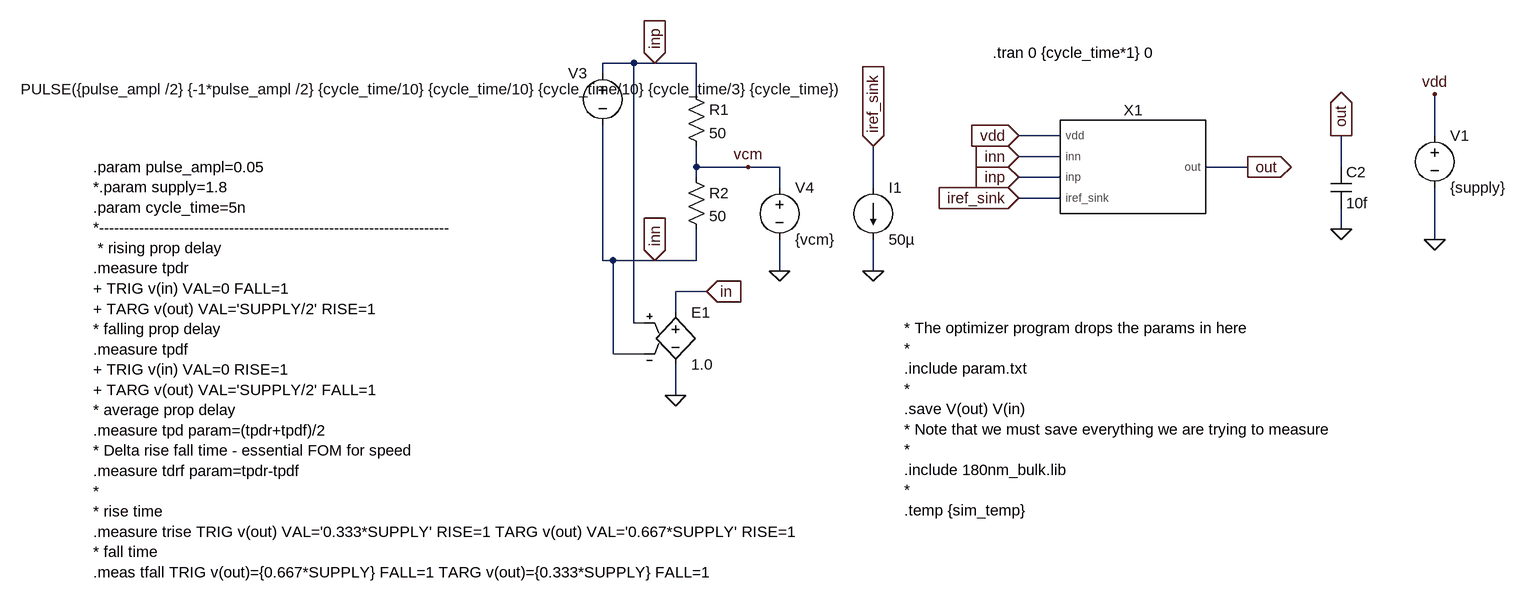
[diagram p0: schematic lvds_rcvr_testbed_v3.asc]
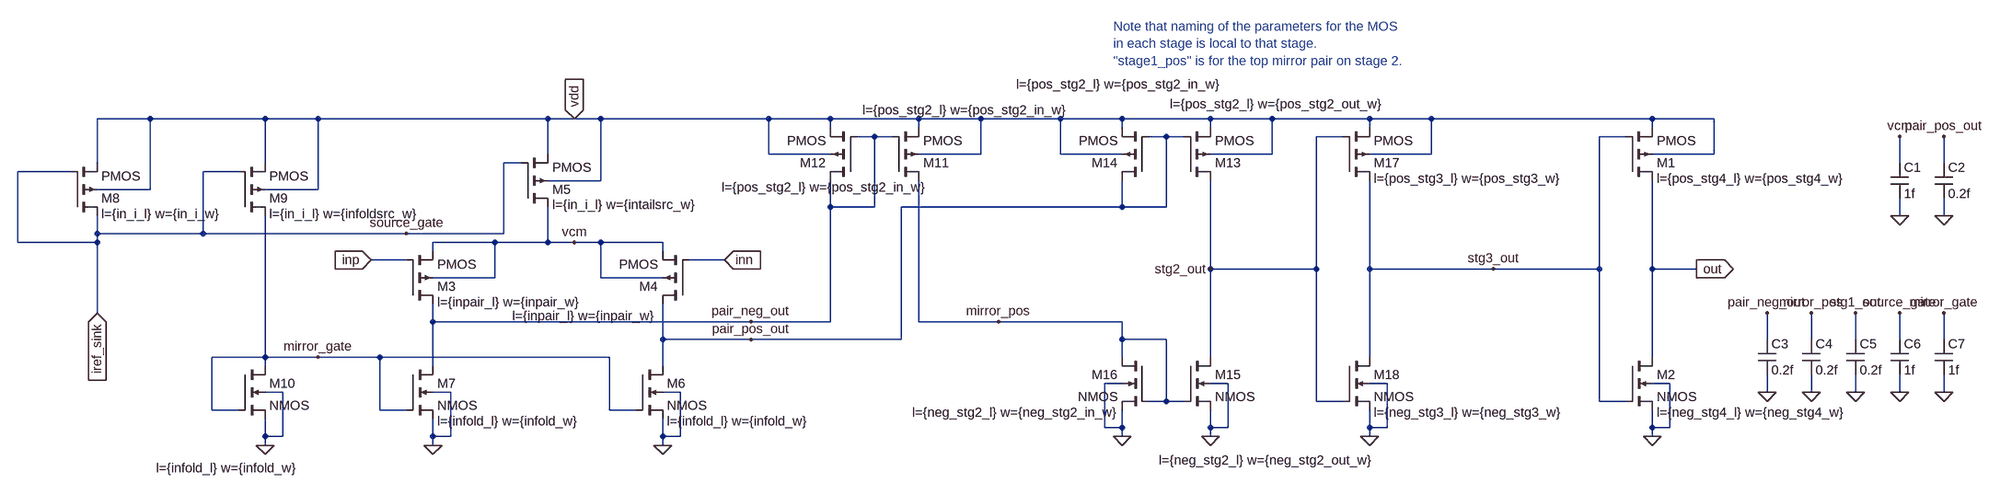
[diagram p1: sub-circuit lvds_rcvr_v4.asc]
lvds_rcvr_testbed_v3.asc, the LTspice schematic file:
Version 4
SHEET 1 2228 1108
WIRE -768 96 -816 96
WIRE -736 96 -768 96
WIRE -672 96 -736 96
WIRE -816 112 -816 96
WIRE -672 144 -672 96
WIRE -112 208 -176 208
WIRE 464 208 464 144
WIRE -112 240 -176 240
WIRE -672 256 -672 224
WIRE -592 256 -672 256
WIRE -544 256 -592 256
WIRE 176 256 112 256
WIRE 320 256 320 208
WIRE -672 272 -672 256
WIRE -112 272 -176 272
WIRE -544 288 -544 256
WIRE -400 288 -400 224
WIRE -112 304 -176 304
WIRE 320 352 320 320
WIRE 464 368 464 288
WIRE -816 400 -816 192
WIRE -800 400 -816 400
WIRE -736 400 -800 400
WIRE -672 400 -672 352
WIRE -672 400 -736 400
WIRE -544 416 -544 368
WIRE -400 416 -400 368
WIRE -656 448 -704 448
WIRE -704 480 -704 448
WIRE -768 496 -768 96
WIRE -752 496 -768 496
WIRE -800 544 -800 400
WIRE -752 544 -800 544
WIRE -704 608 -704 560
FLAG 464 368 0
FLAG 464 144 vdd
FLAG -176 208 vdd
IOPIN -176 208 In
FLAG -400 416 0
FLAG -176 272 inp
IOPIN -176 272 In
FLAG -176 240 inn
IOPIN -176 240 In
FLAG 176 256 out
IOPIN 176 256 Out
FLAG -176 304 iref_sink
IOPIN -176 304 In
FLAG -400 224 iref_sink
IOPIN -400 224 In
FLAG -736 96 inp
IOPIN -736 96 In
FLAG -736 400 inn
IOPIN -736 400 In
FLAG -544 416 0
FLAG -592 256 vcm
FLAG 320 352 0
FLAG 320 208 out
IOPIN 320 208 Out
FLAG -704 608 0
FLAG -656 448 in
IOPIN -656 448 In
SYMBOL voltage 464 192 R0
WINDOW 123 0 0 Left 0
WINDOW 39 0 0 Left 0
SYMATTR InstName V1
SYMATTR Value {supply}
SYMBOL current -400 288 R0
WINDOW 123 0 0 Left 0
WINDOW 39 0 0 Left 0
SYMATTR InstName I1
SYMATTR Value 50µ
SYMBOL voltage -816 96 M0
WINDOW 123 0 0 Left 0
WINDOW 39 0 0 Left 0
WINDOW 3 -379 40 Left 2
SYMATTR Value PULSE({pulse_ampl /2} {-1*pulse_ampl /2} {cycle_time/10} {cycle_time/10} {cycle_time/10} {cycle_time/3} {cycle_time})
SYMATTR InstName V3
SYMBOL res -688 128 R0
SYMATTR InstName R1
SYMATTR Value 50
SYMBOL res -688 256 R0
SYMATTR InstName R2
SYMATTR Value 50
SYMBOL voltage -544 272 R0
WINDOW 123 0 0 Left 0
WINDOW 39 0 0 Left 0
SYMATTR InstName V4
SYMATTR Value {vcm}
SYMBOL cap 304 256 R0
SYMATTR InstName C2
SYMATTR Value 10f
SYMBOL e -704 464 R0
SYMATTR InstName E1
SYMATTR Value 1.0
SYMBOL lvds_rcvr_v4 0 256 R0
SYMATTR InstName X1
TEXT -216 80 Left 2 !.tran 0 {cycle_time*1} 0
TEXT -1600 256 Left 2 !.param pulse_ampl=0.05 \n*.param supply=1.8\n.param cycle_time=5n\n*----------------------------------------------------------------------\n * rising prop delay\n.measure tpdr\n+ TRIG v(in) VAL=0 FALL=1\n+ TARG v(out) VAL='SUPPLY/2' RISE=1\n* falling prop delay\n.measure tpdf \n+ TRIG v(in) VAL=0 RISE=1\n+ TARG v(out) VAL='SUPPLY/2' FALL=1\n* average prop delay\n.measure tpd param=(tpdr+tpdf)/2\n* Delta rise fall time - essential FOM for speed\n.measure tdrf param=tpdr-tpdf\n*\n* rise time\n.measure trise TRIG v(out) VAL='0.333*SUPPLY' RISE=1 TARG v(out) VAL='0.667*SUPPLY' RISE=1\n* fall time\n.meas tfall TRIG v(out)={0.667*SUPPLY} FALL=1 TARG v(out)={0.333*SUPPLY} FALL=1
TEXT -352 504 Left 2 !* The optimizer program drops the params in here\n*\n.include param.txt\n*\n.save V(out) V(in)\n* Note that we must save everything we are trying to measure\n*\n.include 180nm_bulk.lib\n*\n.temp {sim_temp}

lvds_rcvr_v4.asc, the sub-circuit schematic file:
Version 4
SHEET 1 3016 1108
WIRE -448 336 -544 336
WIRE -240 336 -448 336
WIRE -144 336 -240 336
WIRE 272 336 -144 336
WIRE 320 336 272 336
WIRE 368 336 320 336
WIRE 672 336 368 336
WIRE 784 336 672 336
WIRE 944 336 784 336
WIRE 1056 336 944 336
WIRE 1200 336 1056 336
WIRE 1312 336 1200 336
WIRE 1472 336 1312 336
WIRE 1584 336 1472 336
WIRE 1760 336 1584 336
WIRE 1872 336 1760 336
WIRE 2272 336 1872 336
WIRE 2384 336 2272 336
WIRE 784 352 784 336
WIRE 944 352 944 336
WIRE 1312 352 1312 336
WIRE 1472 352 1472 336
WIRE 1760 352 1760 336
WIRE 2272 352 2272 336
WIRE 864 368 832 368
WIRE 896 368 864 368
WIRE 1392 368 1360 368
WIRE 1424 368 1392 368
WIRE 1712 368 1664 368
WIRE 2224 368 2176 368
WIRE 272 400 272 336
WIRE 672 400 672 336
WIRE 784 400 672 400
WIRE 1056 400 1056 336
WIRE 1056 400 944 400
WIRE 1200 400 1200 336
WIRE 1312 400 1200 400
WIRE 1584 400 1584 336
WIRE 1584 400 1472 400
WIRE 1872 400 1872 336
WIRE 1872 400 1760 400
WIRE 2384 400 2384 336
WIRE 2384 400 2272 400
WIRE -544 416 -544 336
WIRE -240 416 -240 336
WIRE 224 416 192 416
WIRE 2720 416 2720 368
WIRE 2800 416 2800 368
WIRE -592 432 -688 432
WIRE -288 432 -352 432
WIRE 368 448 368 336
WIRE 368 448 272 448
WIRE -448 464 -448 336
WIRE -448 464 -544 464
WIRE -144 464 -144 336
WIRE -144 464 -240 464
WIRE 784 496 784 448
WIRE 864 496 864 368
WIRE 864 496 784 496
WIRE 1312 496 1312 448
WIRE 1312 496 912 496
WIRE 1392 496 1392 368
WIRE 1392 496 1312 496
WIRE 2720 512 2720 480
WIRE 2800 512 2800 480
WIRE -544 544 -544 512
WIRE -352 544 -352 432
WIRE -352 544 -544 544
WIRE 16 544 -352 544
WIRE 192 544 192 416
WIRE 192 544 16 544
WIRE -688 560 -688 432
WIRE -544 560 -544 544
WIRE -544 560 -688 560
WIRE 176 560 64 560
WIRE 272 560 272 496
WIRE 272 560 176 560
WIRE 320 560 272 560
WIRE 368 560 320 560
WIRE 480 560 368 560
WIRE 64 576 64 560
WIRE 480 576 480 560
WIRE 16 592 -48 592
WIRE 592 592 528 592
WIRE 1472 608 1472 448
WIRE 1664 608 1664 368
WIRE 1664 608 1472 608
WIRE 1760 608 1760 448
WIRE 1984 608 1760 608
WIRE 2176 608 2176 368
WIRE 2176 608 1984 608
WIRE 2272 608 2272 448
WIRE 2352 608 2272 608
WIRE 176 624 176 560
WIRE 176 624 64 624
WIRE 368 624 368 560
WIRE 480 624 368 624
WIRE -544 688 -544 560
WIRE 64 704 64 672
WIRE 640 704 64 704
WIRE 784 704 784 496
WIRE 784 704 640 704
WIRE 944 704 944 448
WIRE 1088 704 944 704
WIRE 1312 704 1088 704
WIRE 480 736 480 672
WIRE 640 736 480 736
WIRE 912 736 912 496
WIRE 912 736 640 736
WIRE 1312 736 1312 704
WIRE 1392 736 1312 736
WIRE 2480 736 2480 688
WIRE 2560 736 2560 688
WIRE 2640 736 2640 688
WIRE 2720 736 2720 688
WIRE 2800 736 2800 688
WIRE -240 768 -240 512
WIRE -240 768 -336 768
WIRE -144 768 -240 768
WIRE -32 768 -144 768
WIRE 384 768 -32 768
WIRE 1312 768 1312 736
WIRE 1472 768 1472 608
WIRE 1760 768 1760 608
WIRE 2272 768 2272 608
WIRE -240 784 -240 768
WIRE 64 784 64 704
WIRE 480 784 480 736
WIRE 1312 816 1280 816
WIRE 1504 816 1472 816
WIRE 1792 816 1760 816
WIRE 2304 816 2272 816
WIRE -208 832 -240 832
WIRE 96 832 64 832
WIRE 512 832 480 832
WIRE 2480 832 2480 800
WIRE 2560 832 2560 800
WIRE 2640 832 2640 800
WIRE 2720 832 2720 800
WIRE 2800 832 2800 800
WIRE 1392 848 1392 736
WIRE 1392 848 1360 848
WIRE 1424 848 1392 848
WIRE 1664 848 1664 608
WIRE 1712 848 1664 848
WIRE 2176 848 2176 608
WIRE 2224 848 2176 848
WIRE -336 864 -336 768
WIRE -288 864 -336 864
WIRE -32 864 -32 768
WIRE 16 864 -32 864
WIRE 384 864 384 768
WIRE 432 864 384 864
WIRE 1280 896 1280 816
WIRE 1312 896 1312 864
WIRE 1312 896 1280 896
WIRE 1472 896 1472 864
WIRE 1504 896 1504 816
WIRE 1504 896 1472 896
WIRE 1760 896 1760 864
WIRE 1792 896 1792 816
WIRE 1792 896 1760 896
WIRE 2272 896 2272 864
WIRE 2304 896 2304 816
WIRE 2304 896 2272 896
WIRE -240 912 -240 880
WIRE -208 912 -208 832
WIRE -208 912 -240 912
WIRE 64 912 64 880
WIRE 96 912 96 832
WIRE 96 912 64 912
WIRE 480 912 480 880
WIRE 512 912 512 832
WIRE 512 912 480 912
WIRE 1312 912 1312 896
WIRE 1472 912 1472 896
WIRE 1760 912 1760 896
WIRE 2272 912 2272 896
WIRE -240 928 -240 912
WIRE 64 928 64 912
WIRE 480 928 480 912
FLAG 64 928 0
FLAG 480 928 0
FLAG 320 336 vdd
IOPIN 320 336 In
FLAG -48 592 inp
IOPIN -48 592 In
FLAG 592 592 inn
IOPIN 592 592 In
FLAG -240 928 0
FLAG -144 768 mirror_gate
FLAG 16 544 source_gate
FLAG 1472 912 0
FLAG 1312 912 0
FLAG 1088 704 mirror_pos
FLAG 1472 608 stg2_out
FLAG 1760 912 0
FLAG 2352 608 out
IOPIN 2352 608 Out
FLAG -544 688 iref_sink
IOPIN -544 688 In
FLAG 320 560 vcm
FLAG 2720 512 0
FLAG 2720 368 vcm
FLAG 2800 512 0
FLAG 2800 368 pair_pos_out
FLAG 2480 832 0
FLAG 2560 832 0
FLAG 2640 832 0
FLAG 2720 832 0
FLAG 2800 832 0
FLAG 2480 688 pair_neg_out
FLAG 2560 688 mirror_pos
FLAG 2640 688 stg1_out
FLAG 2720 688 source_gate
FLAG 2800 688 mirror_gate
FLAG 2272 912 0
FLAG 1984 608 stg3_out
FLAG 640 736 pair_pos_out
FLAG 640 704 pair_neg_out
SYMBOL pmos4 16 672 M180
WINDOW 123 56 4 Left 2
SYMATTR Value2 l={inpair_l} w={inpair_w}
SYMATTR InstName M3
SYMBOL pmos4 528 672 R180
WINDOW 123 61 -21 Left 2
SYMATTR Value2 l={inpair_l} w={inpair_w}
SYMATTR InstName M4
SYMBOL pmos4 224 496 M180
WINDOW 123 56 4 Left 2
SYMATTR Value2 l={in_i_l} w={intailsrc_w}
SYMATTR InstName M5
SYMBOL nmos4 432 784 R0
WINDOW 123 56 100 Left 2
SYMATTR Value2 l={infold_l} w={infold_w}
SYMATTR InstName M6
SYMBOL nmos4 16 784 R0
WINDOW 123 56 100 Left 2
SYMATTR Value2 l={infold_l} w={infold_w}
SYMATTR InstName M7
SYMBOL pmos4 -592 512 M180
WINDOW 123 56 4 Left 2
SYMATTR Value2 l={in_i_l} w={in_i_w}
SYMATTR InstName M8
SYMBOL pmos4 -288 512 M180
WINDOW 123 56 4 Left 2
SYMATTR Value2 l={in_i_l} w={infoldsrc_w}
SYMATTR InstName M9
SYMBOL nmos4 -288 784 R0
WINDOW 123 -149 185 Left 2
SYMATTR Value2 l={infold_l} w={infold_w}
SYMATTR InstName M10
SYMBOL pmos4 896 448 M180
WINDOW 123 -54 128 Left 2
SYMATTR Value2 l={pos_stg2_l} w={pos_stg2_in_w}
SYMATTR InstName M11
SYMBOL pmos4 832 448 R180
WINDOW 123 -124 -12 Left 2
SYMATTR Value2 l={pos_stg2_l} w={pos_stg2_in_w}
SYMATTR InstName M12
SYMBOL pmos4 1424 448 M180
WINDOW 123 -25 139 Left 2
SYMATTR Value2 l={pos_stg2_l} w={pos_stg2_out_w}
SYMATTR InstName M13
SYMBOL pmos4 1360 448 R180
WINDOW 123 -129 175 Left 2
SYMATTR Value2 l={pos_stg2_l} w={pos_stg2_in_w}
SYMATTR InstName M14
SYMBOL nmos4 1424 768 R0
WINDOW 123 -45 187 Left 2
SYMATTR Value2 l={neg_stg2_l} w={neg_stg2_out_w}
SYMATTR InstName M15
SYMBOL nmos4 1360 768 M0
WINDOW 123 56 100 Left 2
SYMATTR Value2 l={neg_stg2_l} w={neg_stg2_in_w}
SYMATTR InstName M16
SYMBOL pmos4 1712 448 M180
WINDOW 123 56 4 Left 2
SYMATTR Value2 l={pos_stg3_l} w={pos_stg3_w}
SYMATTR InstName M17
SYMBOL nmos4 1712 768 R0
WINDOW 123 56 100 Left 2
SYMATTR Value2 l={neg_stg3_l} w={neg_stg3_w}
SYMATTR InstName M18
SYMBOL cap 2704 416 R0
SYMATTR InstName C1
SYMATTR Value 1f
SYMBOL cap 2784 416 R0
SYMATTR InstName C2
SYMATTR Value 0.2f
SYMBOL cap 2464 736 R0
SYMATTR InstName C3
SYMATTR Value 0.2f
SYMBOL cap 2544 736 R0
SYMATTR InstName C4
SYMATTR Value 0.2f
SYMBOL cap 2624 736 R0
SYMATTR InstName C5
SYMATTR Value 0.2f
SYMBOL cap 2704 736 R0
SYMATTR InstName C6
SYMATTR Value 1f
SYMBOL cap 2784 736 R0
SYMATTR InstName C7
SYMATTR Value 1f
SYMBOL pmos4 2224 448 M180
WINDOW 123 56 4 Left 2
SYMATTR Value2 l={pos_stg4_l} w={pos_stg4_w}
SYMATTR InstName M1
SYMBOL nmos4 2224 768 R0
WINDOW 123 56 100 Left 2
SYMATTR Value2 l={neg_stg4_l} w={neg_stg4_w}
SYMATTR InstName M2
TEXT 1296 168 Left 2 ;Note that naming of the parameters for the MOS\nin each stage is local to that stage.\n"stage1_pos" is for the top mirror pair on stage 2.

The netlist it stands for:
* lvds_rcvr_testbed_v3.asc
V1 vdd 0 {supply}
I1 iref_sink 0 50µ
V3 inp inn PULSE({pulse_ampl /2} {-1*pulse_ampl /2} {cycle_time/10} {cycle_time/10} {cycle_time/10} {cycle_time/3} {cycle_time})
R1 inp vcm 50
R2 vcm inn 50
V4 vcm 0 {vcm}
C2 out 0 10f
E1 in 0 inp inn 1.0
XX1 inn inp iref_sink vdd out lvds_rcvr_v4

* block symbol definitions
.subckt lvds_rcvr_v4 inn inp iref_sink vdd out
M3 pair_neg_out inp vcm vcm PMOS l={inpair_l} w={inpair_w}
M4 pair_pos_out inn vcm vcm PMOS l={inpair_l} w={inpair_w}
M5 vcm iref_sink vdd vdd PMOS l={in_i_l} w={intailsrc_w}
M6 pair_pos_out mirror_gate 0 0 NMOS l={infold_l} w={infold_w}
M7 pair_neg_out mirror_gate 0 0 NMOS l={infold_l} w={infold_w}
M8 iref_sink iref_sink vdd vdd PMOS l={in_i_l} w={in_i_w}
M9 mirror_gate iref_sink vdd vdd PMOS l={in_i_l} w={infoldsrc_w}
M10 mirror_gate mirror_gate 0 0 NMOS l={infold_l} w={infold_w}
M11 mirror_pos pair_neg_out vdd vdd PMOS l={pos_stg2_l} w={pos_stg2_in_w}
M12 pair_neg_out pair_neg_out vdd vdd PMOS l={pos_stg2_l} w={pos_stg2_in_w}
M13 stg2_out pair_pos_out vdd vdd PMOS l={pos_stg2_l} w={pos_stg2_out_w}
M14 pair_pos_out pair_pos_out vdd vdd PMOS l={pos_stg2_l} w={pos_stg2_in_w}
M15 stg2_out mirror_pos 0 0 NMOS l={neg_stg2_l} w={neg_stg2_out_w}
M16 mirror_pos mirror_pos 0 0 NMOS l={neg_stg2_l} w={neg_stg2_in_w}
M17 stg3_out stg2_out vdd vdd PMOS l={pos_stg3_l} w={pos_stg3_w}
M18 stg3_out stg2_out 0 0 NMOS l={neg_stg3_l} w={neg_stg3_w}
C1 vcm 0 1f
C2 pair_pos_out 0 0.2f
C3 pair_neg_out 0 0.2f
C4 mirror_pos 0 0.2f
C5 stg1_out 0 0.2f
C6 iref_sink 0 1f
C7 mirror_gate 0 1f
M1 out stg3_out vdd vdd PMOS l={pos_stg4_l} w={pos_stg4_w}
M2 out stg3_out 0 0 NMOS l={neg_stg4_l} w={neg_stg4_w}
* Note that naming of the parameters for the MOS
* in each stage is local to that stage.
* "stage1_pos" is for the top mirror pair on stage 2.
.ends lvds_rcvr_v4

.model NMOS NMOS
.model PMOS PMOS
.lib standard.mos
.tran 0 {cycle_time*1} 0
.param pulse_ampl=0.05
*.param supply=1.8
.param cycle_time=5n
*----------------------------------------------------------------------
 * rising prop delay
.measure tpdr
+ TRIG v(in) VAL=0 FALL=1
+ TARG v(out) VAL='SUPPLY/2' RISE=1
* falling prop delay
.measure tpdf
+ TRIG v(in) VAL=0 RISE=1
+ TARG v(out) VAL='SUPPLY/2' FALL=1
* average prop delay
.measure tpd param=(tpdr+tpdf)/2
* Delta rise fall time - essential FOM for speed
.measure tdrf param=tpdr-tpdf
*
* rise time
.measure trise TRIG v(out) VAL='0.333*SUPPLY' RISE=1 TARG v(out) VAL='0.667*SUPPLY' RISE=1
* fall time
.meas tfall TRIG v(out)={0.667*SUPPLY} FALL=1 TARG v(out)={0.333*SUPPLY} FALL=1
* The optimizer program drops the params in here
*
.include param.txt
*
.save V(out) V(in)
* Note that we must save everything we are trying to measure
*
.include 180nm_bulk.lib
*
.temp {sim_temp}
.backanno
.end